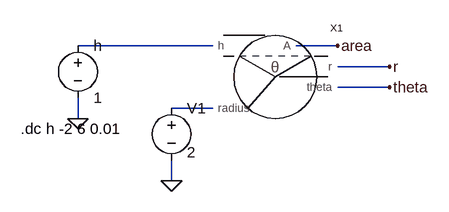
[diagram p0: schematic chord_test.asc]
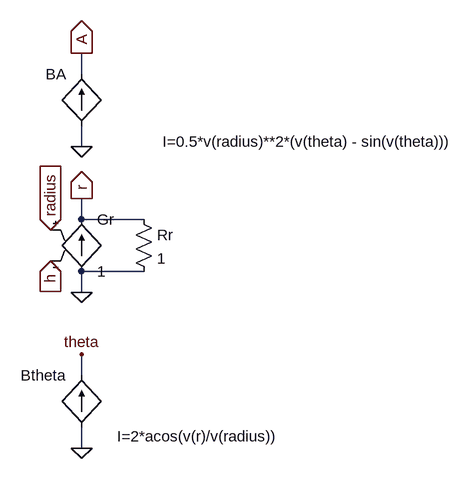
[diagram p1: sub-circuit chord.asc]
chord_test.asc, the LTspice schematic file:
Version 4
SHEET 1 880 680
WIRE 128 64 -80 64
WIRE 320 64 256 64
WIRE 400 96 320 96
WIRE 400 128 320 128
WIRE 128 160 64 160
WIRE -80 176 -80 144
WIRE 64 272 64 240
FLAG 64 272 0
FLAG 320 64 area
FLAG -80 176 0
FLAG 400 96 r
FLAG 400 128 theta
SYMBOL chord 224 112 R0
SYMATTR InstName X1
SYMBOL voltage 64 144 R0
WINDOW 3 24 84 Left 2
WINDOW 123 0 0 Left 0
WINDOW 39 0 0 Left 0
SYMATTR Value 2
SYMATTR InstName V1
SYMBOL voltage -80 48 R0
SYMATTR InstName h
SYMATTR Value 1
TEXT -168 192 Left 2 !.dc h -2 6 0.01

chord.asc, the sub-circuit schematic file:
Version 4
SHEET 1 1588 680
WIRE 320 -96 320 -128
WIRE 320 16 320 -16
WIRE 320 128 320 96
WIRE 416 128 320 128
WIRE 416 208 320 208
WIRE 320 240 320 208
WIRE 320 368 320 336
WIRE 320 480 320 448
FLAG 272 192 h
IOPIN 272 192 In
FLAG 272 144 radius
IOPIN 272 144 In
FLAG 320 -128 A
IOPIN 320 -128 Out
FLAG 320 96 r
IOPIN 320 96 Out
FLAG 320 480 0
FLAG 320 336 theta
FLAG 320 16 0
FLAG 320 240 0
SYMBOL bi 320 448 R180
WINDOW 0 24 80 Left 2
WINDOW 3 -304 -14 Left 2
SYMATTR InstName Btheta
SYMATTR Value I=2*acos(v(r)/v(radius))
SYMATTR SpiceLine rpar=1
SYMBOL bi 320 -16 R180
WINDOW 0 24 80 Left 2
WINDOW 3 -574 -24 Left 2
SYMATTR InstName BA
SYMATTR Value I=0.5*v(radius)**2*(v(theta) - sin(v(theta)))
SYMATTR SpiceLine rpar=1
SYMBOL g 320 112 R0
SYMATTR InstName Gr
SYMATTR Value 1
SYMBOL res 400 112 R0
SYMATTR InstName Rr
SYMATTR Value 1

The netlist it stands for:
* chord_test.asc
XX1 N001 N002 area r theta chord
V1 N002 0 2
V§h N001 0 1

* block symbol definitions
.subckt chord h radius A r theta
Btheta 0 theta I=2*acos(v(r)/v(radius)) rpar=1
BA 0 A I=0.5*v(radius)**2*(v(theta) - sin(v(theta))) rpar=1
Gr 0 r radius h 1
Rr r 0 1
.ends chord

.dc h -2 6 0.01
.backanno
.end

* Results of the author's LTspice run, read from the files saved beside the schematic
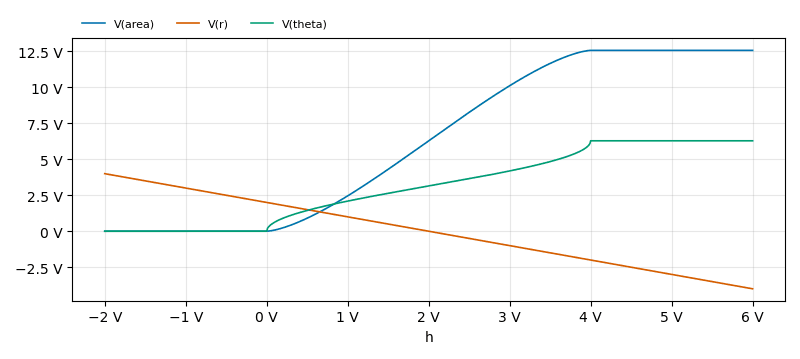
[diagram p2: DC transfer characteristic of chord_test.asc, plotted from the saved traces]
* DC transfer characteristic, 1 run:
*   V(area): 0 V at h=-2 V, 12.57 V at h=6 V, min 0 V, max 12.57 V
*   V(r): 4 V at h=-2 V, -4 V at h=6 V, min -4 V, max 4 V
*   V(theta): 0 V at h=-2 V, 6.283 V at h=6 V, min 0 V, max 6.283 V